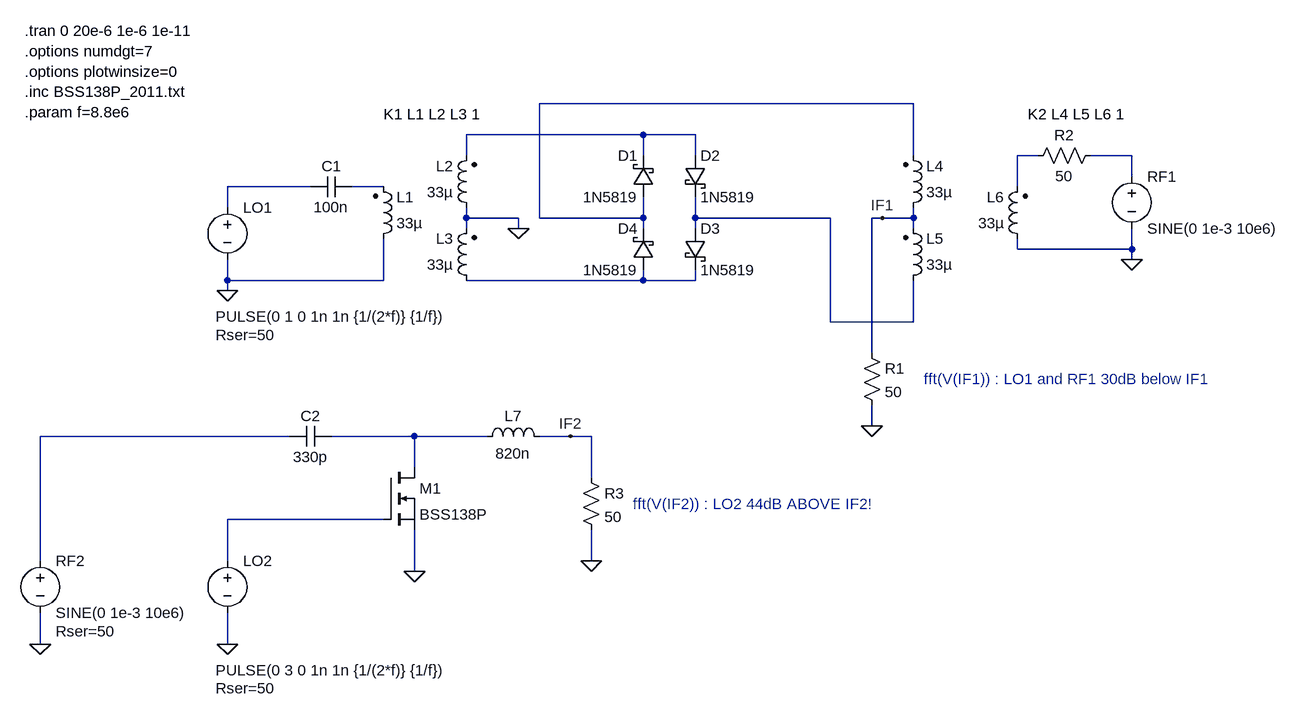
[diagram p0: schematic ringmod_vs_switcher.asc]
ringmod_vs_switcher.asc, the LTspice schematic file:
Version 4
SHEET 1 1048 680
WIRE 464 -304 -112 -304
WIRE 48 -256 -224 -256
WIRE 128 -256 48 -256
WIRE -224 -224 -224 -256
WIRE 48 -224 48 -256
WIRE 128 -224 128 -256
WIRE 464 -224 464 -304
WIRE 656 -224 624 -224
WIRE 800 -224 736 -224
WIRE 800 -192 800 -224
WIRE -464 -176 -592 -176
WIRE -352 -176 -400 -176
WIRE 624 -176 624 -224
WIRE -592 -144 -592 -176
WIRE -224 -128 -224 -144
WIRE -144 -128 -224 -128
WIRE -112 -128 -112 -304
WIRE 48 -128 48 -160
WIRE 48 -128 -112 -128
WIRE 128 -128 128 -160
WIRE 336 -128 128 -128
WIRE 416 -128 400 -128
WIRE 464 -128 464 -144
WIRE 464 -128 416 -128
WIRE -224 -112 -224 -128
WIRE -144 -112 -144 -128
WIRE 48 -112 48 -128
WIRE 128 -112 128 -128
WIRE 464 -112 464 -128
WIRE 624 -80 624 -96
WIRE 800 -80 800 -112
WIRE 800 -80 624 -80
WIRE 800 -64 800 -80
WIRE -592 -32 -592 -64
WIRE -352 -32 -352 -96
WIRE -352 -32 -592 -32
WIRE 48 -32 48 -48
WIRE 48 -32 -224 -32
WIRE 128 -32 128 -48
WIRE 128 -32 48 -32
WIRE -592 -16 -592 -32
WIRE 336 32 336 -128
WIRE 464 32 464 -32
WIRE 464 32 336 32
WIRE 400 80 400 -128
WIRE 400 192 400 160
WIRE -496 208 -880 208
WIRE -304 208 -432 208
WIRE -192 208 -304 208
WIRE -64 208 -112 208
WIRE -32 208 -64 208
WIRE -304 256 -304 208
WIRE -32 272 -32 208
WIRE -352 336 -592 336
WIRE -880 400 -880 208
WIRE -592 400 -592 336
WIRE -32 400 -32 352
WIRE -304 416 -304 352
WIRE -880 528 -880 480
WIRE -592 528 -592 480
FLAG -144 -112 0
FLAG -592 -16 0
FLAG 800 -64 0
FLAG 400 192 0
FLAG 416 -128 IF1
FLAG -592 528 0
FLAG -32 400 0
FLAG -880 528 0
FLAG -304 416 0
FLAG -64 208 IF2
SYMBOL voltage -592 -160 R0
WINDOW 3 -18 184 Left 2
WINDOW 123 0 0 Left 0
WINDOW 39 -18 212 Left 2
SYMATTR Value PULSE(0 1 0 1n 1n {1/(2*f)} {1/f})
SYMATTR SpiceLine Rser=50
SYMATTR InstName LO1
SYMBOL ind2 -368 -80 M180
WINDOW 0 36 80 Left 2
WINDOW 3 36 40 Left 2
SYMATTR InstName L1
SYMATTR Value 33µ
SYMATTR Type ind
SYMBOL ind2 -208 -128 R180
WINDOW 0 36 80 Left 2
WINDOW 3 36 40 Left 2
SYMATTR InstName L2
SYMATTR Value 33µ
SYMATTR Type ind
SYMBOL ind2 -208 -16 R180
WINDOW 0 36 80 Left 2
WINDOW 3 36 40 Left 2
SYMATTR InstName L3
SYMATTR Value 33µ
SYMATTR Type ind
SYMBOL ind2 448 -128 M180
WINDOW 0 36 80 Left 2
WINDOW 3 36 40 Left 2
SYMATTR InstName L4
SYMATTR Value 33µ
SYMATTR Type ind
SYMBOL ind2 448 -16 M180
WINDOW 0 36 80 Left 2
WINDOW 3 36 40 Left 2
SYMATTR InstName L5
SYMATTR Value 33µ
SYMATTR Type ind
SYMBOL ind2 640 -80 R180
WINDOW 0 36 80 Left 2
WINDOW 3 36 40 Left 2
SYMATTR InstName L6
SYMATTR Value 33µ
SYMATTR Type ind
SYMBOL schottky 64 -160 R180
WINDOW 0 24 64 Left 2
WINDOW 3 24 0 Left 2
SYMATTR InstName D1
SYMATTR Value 1N5819
SYMATTR Description Diode
SYMATTR Type diode
SYMBOL voltage 800 -208 R0
WINDOW 123 0 0 Left 0
WINDOW 39 24 124 Left 2
SYMATTR InstName RF1
SYMATTR Value SINE(0 1e-3 10e6)
SYMBOL res 384 64 R0
SYMATTR InstName R1
SYMATTR Value 50
SYMBOL schottky 112 -224 R0
SYMATTR InstName D2
SYMATTR Value 1N5819
SYMATTR Description Diode
SYMATTR Type diode
SYMBOL schottky 112 -112 R0
SYMATTR InstName D3
SYMATTR Value 1N5819
SYMATTR Description Diode
SYMATTR Type diode
SYMBOL schottky 64 -48 R180
WINDOW 0 24 64 Left 2
WINDOW 3 24 0 Left 2
SYMATTR InstName D4
SYMATTR Value 1N5819
SYMATTR Description Diode
SYMATTR Type diode
SYMBOL res 752 -240 R90
WINDOW 0 0 56 VBottom 2
WINDOW 3 32 56 VTop 2
SYMATTR InstName R2
SYMATTR Value 50
SYMBOL cap -400 -192 R90
WINDOW 0 0 32 VBottom 2
WINDOW 3 32 32 VTop 2
SYMATTR InstName C1
SYMATTR Value 100n
SYMBOL voltage -592 384 R0
WINDOW 3 -18 184 Left 2
WINDOW 123 0 0 Left 0
WINDOW 39 -18 212 Left 2
SYMATTR Value PULSE(0 3 0 1n 1n {1/(2*f)} {1/f})
SYMATTR SpiceLine Rser=50
SYMATTR InstName LO2
SYMBOL cap -432 192 R90
WINDOW 0 0 32 VBottom 2
WINDOW 3 32 32 VTop 2
SYMATTR InstName C2
SYMATTR Value 330p
SYMBOL ind -208 224 R270
WINDOW 0 32 56 VTop 2
WINDOW 3 5 56 VBottom 2
SYMATTR InstName L7
SYMATTR Value 820n
SYMBOL res -48 256 R0
SYMATTR InstName R3
SYMATTR Value 50
SYMBOL voltage -880 384 R0
WINDOW 123 0 0 Left 0
WINDOW 39 24 124 Left 2
SYMATTR SpiceLine Rser=50
SYMATTR InstName RF2
SYMATTR Value SINE(0 1e-3 10e6)
SYMBOL nmos -352 256 R0
SYMATTR InstName M1
SYMATTR Value BSS138P
SYMATTR Prefix X
TEXT -352 -288 Left 2 !K1 L1 L2 L3 1
TEXT 640 -288 Left 2 !K2 L4 L5 L6 1
TEXT -904 -416 Left 2 !.tran 0 20e-6 1e-6 1e-11\n.options numdgt=7\n.options plotwinsize=0\n.inc BSS138P_2011.txt\n.param f=8.8e6
TEXT 480 120 Left 2 ;fft(V(IF1)) : LO1 and RF1 30dB below IF1
TEXT 32 312 Left 2 ;fft(V(IF2)) : LO2 44dB ABOVE IF2!

The netlist it stands for:
* ringmod_vs_switcher.asc
V§LO1 N005 0 PULSE(0 1 0 1n 1n {1/(2*f)} {1/f}) Rser=50
L1 0 N006 33µ
L2 0 N002 33µ
L3 N008 0 33µ
L4 IF1 N001 33µ
L5 N007 IF1 33µ
L6 0 N003 33µ
D1 N001 N002 1N5819
V§RF1 N004 0 SINE(0 1e-3 10e6)
R1 IF1 0 50
D2 N002 N007 1N5819
D3 N007 N008 1N5819
D4 N008 N001 1N5819
R2 N004 N003 50
C1 N006 N005 100n
V§LO2 N011 0 PULSE(0 3 0 1n 1n {1/(2*f)} {1/f}) Rser=50
C2 N010 N009 330p
L7 N010 IF2 820n
R3 IF2 0 50
V§RF2 N009 0 SINE(0 1e-3 10e6) Rser=50
XM1 N010 N011 0 BSS138P  ; pins D G S
.model D D
.lib standard.dio
K1 L1 L2 L3 1
K2 L4 L5 L6 1
.tran 0 20e-6 1e-6 1e-11
.options numdgt=7
.options plotwinsize=0
.inc BSS138P_2011.txt
.param f=8.8e6
* fft(V(IF1)) : LO1 and RF1 30dB below IF1
* fft(V(IF2)) : LO2 44dB ABOVE IF2!
.backanno
.end